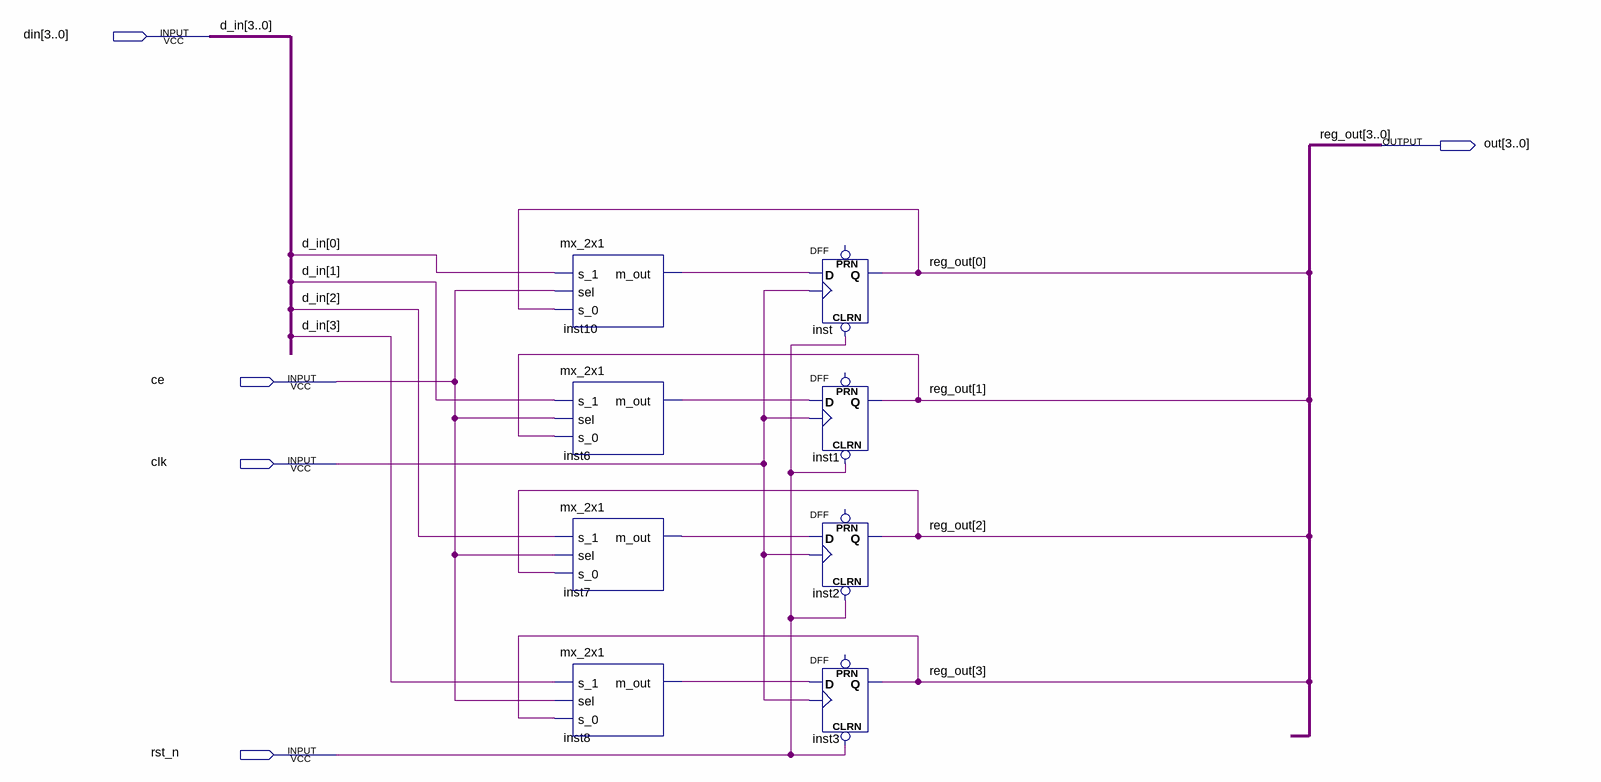
[diagram p0: schematic sheet]
// Quartus schematic four_bit_reg_ce.bdf as structural Verilog: 8 symbols, 5 pins
module four_bit_reg_ce (
  input  [3:0] din,
  input  ce,
  input  clk,
  input  rst_n,
  output [3:0] out
);

  wire inst6_m_out, inst7_m_out, inst8_m_out, inst10_m_out;

  mx_2x1 inst10 (.s_1(din[0]), .sel(ce), .s_0(out[0]), .m_out(inst10_m_out));
  mx_2x1 inst6 (.s_1(din[1]), .sel(ce), .s_0(out[1]), .m_out(inst6_m_out));
  mx_2x1 inst7 (.s_1(din[2]), .sel(ce), .s_0(out[2]), .m_out(inst7_m_out));
  mx_2x1 inst8 (.s_1(din[3]), .sel(ce), .s_0(out[3]), .m_out(inst8_m_out));
  DFF inst (.CLRN(rst_n), .CLK(clk), .D(inst10_m_out), .Q(out[0]));  // open: PRN
  DFF inst1 (.CLRN(rst_n), .CLK(clk), .D(inst6_m_out), .Q(out[1]));  // open: PRN
  DFF inst2 (.CLRN(rst_n), .CLK(clk), .D(inst7_m_out), .Q(out[2]));  // open: PRN
  DFF inst3 (.CLRN(rst_n), .CLK(clk), .D(inst8_m_out), .Q(out[3]));  // open: PRN

  // Other names for the same wires on the sheet: d_in[3:0] = din; reg_out[3:0] = out
endmodule
